# Altium schematic sheet POWER.SchDoc
size A4
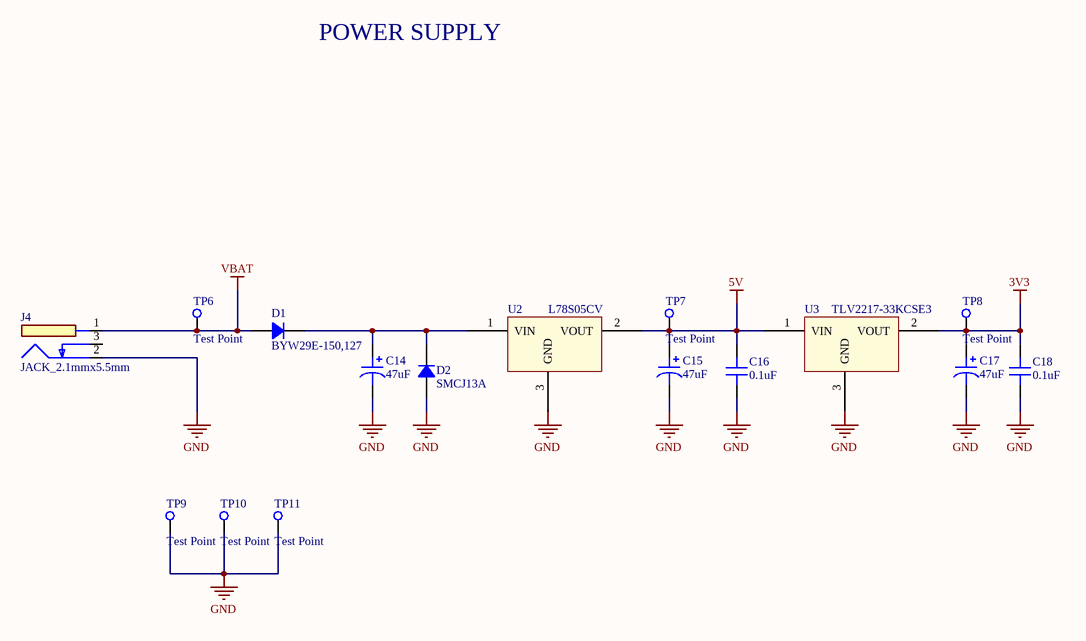
[diagram p0: POWER.SchDoc]

## Parts
C14  47uF  [CAP_POL_D6.3MM_L5.8MM_H6.6MM]
C15  47uF  [CAP_POL_D6.3MM_L5.8MM_H6.6MM]
C16  0.1uF  [C_0805]
C17  47uF  [CAP_POL_D6.3MM_L5.8MM_H6.6MM]
C18  0.1uF  [C_0805]
D1  BYW29E-150,127  [TO-220-2]
D2  SMCJ13A  [DO-214AB-2]
J4  JACK_2.1mmx5.5mm  [JACK_2.1mmx5.5mm]
TP6  Test Point  [Test_Point]
TP7  Test Point  [Test_Point]
TP8  Test Point  [Test_Point]
TP9  Test Point  [Test_Point]
TP10  Test Point  [Test_Point]
TP11  Test Point  [Test_Point]
U2  L78S05CV  [TO-220]
U3  TLV2217-33KCSE3  [TO-220]

## Nets
3V3: C17.1 C18.2 TP8.1(TP) U3.2(VOUT)
5V: C15.1 C16.2 TP7.1(TP) U2.2(VOUT) U3.1(VIN)
GND: C14.2 C15.2 C16.1 C17.2 C18.1 D2.1 J4.2 TP9.1(TP) TP10.1(TP) TP11.1(TP) U2.3(GND) U3.3(GND)
VBAT: D1.1 J4.1 TP6.1(TP)
NetC14_1: C14.1 D1.2 D2.2 U2.1(VIN)

Not connected (* = marked no-connect by the designer): J4 3

## Notes on the sheet
- POWER SUPPLY

## Library data of the parts
C14 C15 C17 = C_POL_UWT1V470MCL1GS: CAP 47UF 35V ELECT WT SMD D6.3MM L5.8MM H 6.6MM; Part Number: UWT1V470MCL1GS; Datasheet: https://br.mouser.com/datasheet/2/293/e-wt-30307.pdf; Supplier: https://br.mouser.com/ProductDetail/Nichicon/UWT1V470MCL1GS?qs=ljCeji4nMDl8Y30ehuNAUQ%3D%3D; Value: 47uF; Voltage: 35V
C16 C18 = C_0805_GRM21BR71H104KA01L: CAP CER .1UF 50V 10% X7R 080; Part Number: GRM21BR71H104KA01L; Datasheet: https://br.mouser.com/datasheet/2/281/murata_03052018_GRM_Series_1-1310166.pdf; Supplier: https://br.mouser.com/ProductDetail/Murata-Electronics/GRM21BR71H104KA01L?qs=JovLnzPPZAL81o2XNDa%2FDA%3D%3D; Value: 0.1uF; Voltage: 50V
D1 = DIODE_BYW29E-150,127: DIODE RECT UFAST 150V TO220AC SOD59; Part Number: BYW29E-150,127; Supplier: https://br.mouser.com/ProductDetail/WeEn-Semiconductors/BYW29E-150127?qs=me8TqzrmIYVz9CWyXJlNFA%3D%3D; Datasheet: https://br.mouser.com/datasheet/2/848/byw29e-150-1520821.pdf; Voltage: 150V; Power: *
D2 = DIODE_SMCJ13A: DIODE TVS 13V 1500W UNI 5% SMC DO-214AB-2_; Voltage: 150V; Part Number: SMCJ13A; Supplier: https://br.mouser.com/ProductDetail/Littelfuse/SMCJ13A?qs=JJML70Qc14udM04Txwcydg%3D%3D; Datasheet: https://br.mouser.com/datasheet/2/848/byw29e-150-1520821.pdf; Power: 1500W
J4 = JACK_2.1mmx5.5mm: Jack/Connector 2.1mm x 5.5mm; Part Number: CON-SOCJ-2155; Manufacturer: Gravitech; Datasheet: http://www.gravitech.us/poja2x51.html; Supplier: https://br.mouser.com/ProductDetail/Gravitech/CON-SOCJ-2155?qs=sGAEpiMZZMvtrnhC60i%252BOueHg%2FyK0jmoLPszqcLww24%3D
U2 = REGULATOR_L78S05CV: IC REG POSITIVE 2A 5V TO-220; Part Number: L78S05CV; Datasheet: https://br.mouser.com/datasheet/2/389/l78s-974158.pdf; Supplier: https://br.mouser.com/ProductDetail/STMicroelectronics/L78S05CV-DG?qs=UOUhb9503hFQHy635AeyYA%3D%3D
U3 = REGULATOR_TLV2217: IC LDO REG FXDVOLT 3.3V TO-220; Part Number: TLV2217-33KCSE3; Datasheet: http://www.ti.com/general/docs/suppproductinfo.tsp?distId=26&gotoUrl=http%3A%2F%2Fwww.ti.com%2Flit%2Fgpn%2Ftlv2217; Supplier: https://br.mouser.com/ProductDetail/Texas-Instruments/TLV2217-33KCSE3?qs=LVErsypW30y56XyeRJBjlA%3D%3D